# Altium schematic sheet MCU电源.SchDoc
size A4
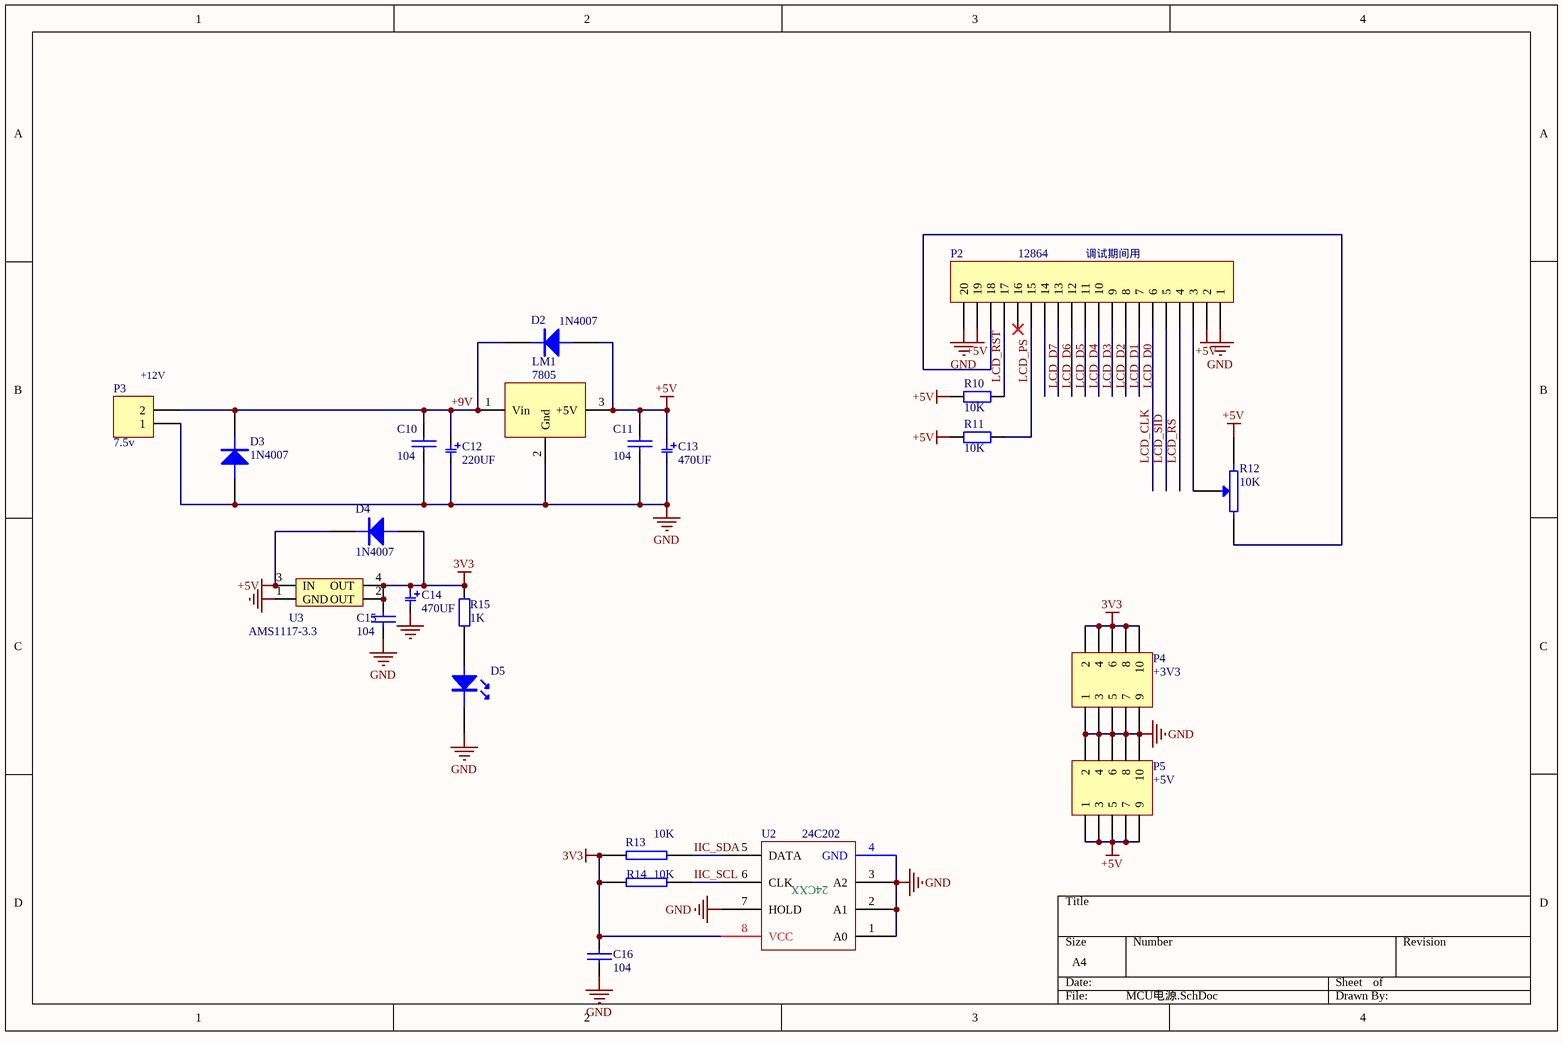
[diagram p0: MCU电源.SchDoc]

## Parts
C10  104  [1206]
C11  104  [1206]
C12  220UF  [C220U]
C13  470UF  [C220U]
C14  470UF  [C220U]
C15  104  [1206]
C16  104  [1206]
D2  1N4007  [7227]
D3  1N4007  [7227]
D4  1N4007  [7227]
D5  (no value)  [LED]
LM1  7805  [TO-220]
P2  12864  [HDR1X20]
P3  7.5v  [OUT_CJ]
P4  +3V3  [HDR2X5]
P5  +5V  [HDR2X5]
R10  10K  [1206]
R11  10K  [1206]
R12  10K  [VR]
R13  10K  [1206]
R14  10K  [1206]
R15  1K  [1206]
U2  24C202  [SO-8]
U3  AMS1117-3.3  [AMS1117]

## Nets
3V3: C14.1 C15.2 C16.2 D4.1(A) P4.2 P4.4 P4.6 P4.8 P4.10 R13.1 R14.1 R15.1 U2.8(VCC) U3.2(OUT) U3.4(OUT)
+5V: C11.2 C13.1 D2.1(A) D4.2(K) LM1.3(+5V) P2.2 P2.19 P5.1 P5.3 P5.5 P5.7 P5.9 R10.1 R11.1 R12.2 U3.3(IN)
GND: C10.1 C11.1 C12.2 C13.2 C14.2 C15.1 C16.1 D3.1(A) D5.K LM1.2(Gnd) P2.1 P2.20 P3.1 P4.1 P4.3 P4.5 P4.7 P4.9 P5.2 P5.4 P5.6 P5.8 P5.10 U2.1(A0) U2.2(A1) U2.3(A2) U2.4(GND) U2.7(HOLD) U3.1(GND)
+9V: C10.2 C12.1 D2.2(K) D3.2(K) LM1.1(Vin) P3.2
IIC_SCL: R14.2 U2.6(CLK)
IIC_SDA: R13.2 U2.5(DATA)
LCD_CLK: P2.6
LCD_D0: P2.7
LCD_D1: P2.8
LCD_D2: P2.9
LCD_D3: P2.10
LCD_D4: P2.11
LCD_D5: P2.12
LCD_D6: P2.13
LCD_D7: P2.14
LCD_PS: P2.15 R11.2
LCD_RS: P2.4
LCD_RST: P2.17 R10.2
LCD_SID: P2.5
NetD5_A: D5.A R15.2
NetP2_3: P2.3 R12.3(W)
NetP2_18: P2.18 R12.1

Not connected (* = marked no-connect by the designer): P2 16*

## Notes on the sheet
- (near P2) 调试期间用
- (near P3) +12V

## Library data of the parts
C10 C11 C15 = 普通电容: Capacitor
C12-C14 = ECAP
C16 = CAP: Capacitor
D2-D4 = DIODE
D5 = 发光二极管
LM1 = LM7805CT
P2 = Header 20: Header, 20-Pin; LatestRevisionDate: 17-Jul-2002; LatestRevisionNote: Re-released for DXP Platform.; Publisher: Altium Limited
P3 = Header 2: Header, 2-Pin; LatestRevisionDate: 17-Jul-2002; LatestRevisionNote: Re-released for DXP Platform.; Publisher: Altium Limited
P4 P5 = Header 5X2: Header, 5-Pin, Dual row; LatestRevisionDate: 17-Jul-2002; LatestRevisionNote: Re-released for DXP Platform.; Publisher: Altium Limited
R10 R11 = Res2: Resistor; Published: 8-Jun-2000; LatestRevisionDate: 17-Jul-2002; LatestRevisionNote: Re-released for DXP Platform.; PackageReference: AXIAL-0.4; Publisher: Altium Limited; PackageDescription: Axial Device, Thru-Hole; 2 Leads; 0.4 in Pin Spacing; Value: 10K
R12 = RESVR: Potentiometer
R13 R14 = RES2
R15 = Res2: Resistor; Value: 10K; Published: 8-Jun-2000; LatestRevisionDate: 17-Jul-2002; LatestRevisionNote: Re-released for DXP Platform.; PackageReference: AXIAL-0.4; Publisher: Altium Limited; PackageDescription: Axial Device, Thru-Hole; 2 Leads; 0.4 in Pin Spacing
U2 = 24CXX
U3 = AMS1117